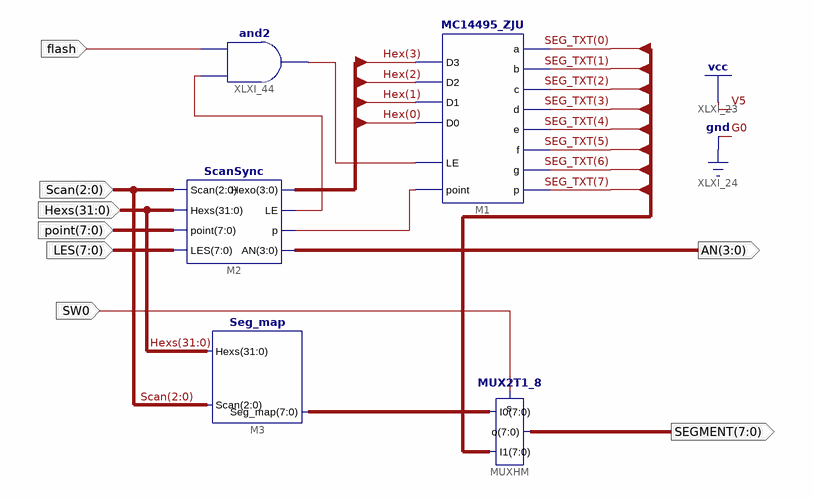
[diagram p0: schematic sheet 1]
// Xilinx ISE schematic Seg7_Dev.sch (kintex7) as structural Verilog: 5 symbols, 8 ports
module Seg7_Dev (
  input  flash,
  input  [2:0] Scan,
  input  [31:0] Hexs,
  input  [7:0] point,
  input  [7:0] LES,
  input  SW0,
  output [3:0] AN,
  output [7:0] SEGMENT
);

  wire XLXN_271, XLXN_382, XLXN_385;
  wire [3:0] Hex;
  wire [7:0] SEG_MAP, SEG_TXT;

  MC14495_ZJU M1 (
    .D0(Hex[0]), .D1(Hex[1]), .D2(Hex[2]), .D3(Hex[3]), .p(SEG_TXT[7]), .g(SEG_TXT[6]), .f(SEG_TXT[5]),
    .e(SEG_TXT[4]), .d(SEG_TXT[3]), .c(SEG_TXT[2]), .b(SEG_TXT[1]), .a(SEG_TXT[0]), .point(XLXN_271),
    .LE(XLXN_385));
  ScanSync M2 (.LES(LES), .AN(AN), .point(point), .p(XLXN_271), .Hexo(Hex), .Hexs(Hexs), .Scan(Scan), .LE(XLXN_382));
  and XLXI_44 (XLXN_385, XLXN_382, flash);
  Seg_map M3 (.Hexs(Hexs), .Seg_map(SEG_MAP), .Scan(Scan));
  MUX2T1_8 MUXHM (.o(SEGMENT), .I0(SEG_MAP), .s(SW0), .I1(SEG_TXT));
endmodule
